# Altium schematic sheet BPF.SchDoc: Ararinha 6F
size A4; Revision: 2.0; SheetNumber: 6; SheetTotal: 7
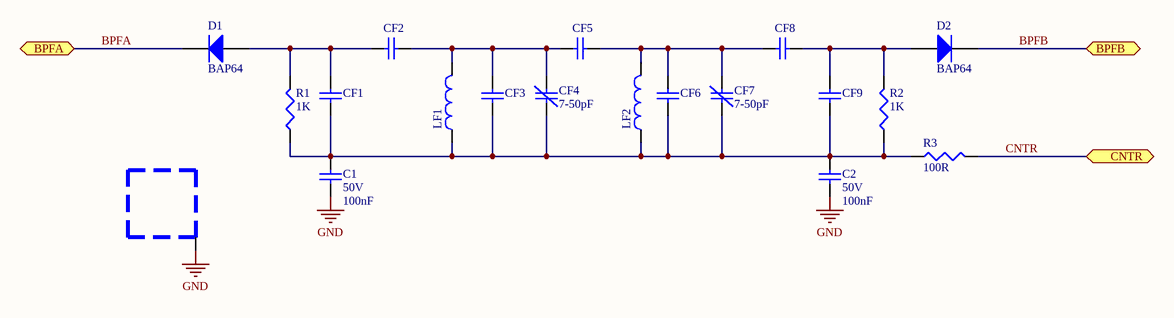
[diagram p0: BPF.SchDoc]

## Parts
BL1  Blindagem BPF  [SHIELD_26.5X26.5]  (value not drawn)
C1  value 100nF  Tensão: 50V  [CC0603]  (hidden comment: Capacitor Cerâmico)
C2  value 100nF  Tensão: 50V  [CC0603]  (hidden comment: Capacitor Cerâmico)
CF1  Capacitor Cerâmico  [CC0603]  (value not drawn)
CF2  Capacitor Cerâmico  [CC0603]  (value not drawn)
CF3  Capacitor Cerâmico  [CC0603]  (value not drawn)
CF4  value 7-50pF  [MURATA TZB4]  (hidden comment: Trimmer)
CF5  Capacitor Cerâmico  [CC0603]  (value not drawn)
CF6  Capacitor Cerâmico  [CC0603]  (value not drawn)
CF7  value 7-50pF  [MURATA TZB4]  (hidden comment: Trimmer)
CF8  Capacitor Cerâmico  [CC0603]  (value not drawn)
CF9  Capacitor Cerâmico  [CC0603]  (value not drawn)
D1  BAP64  [SOD523]
D2  BAP64  [SOD523]
LF1  Bead  [CC0603]  (value not drawn)
LF2  Bead  [CC0603]  (value not drawn)
R1  value 1K  [CC0603]  (hidden comment: Resistor)
R2  value 1K  [CC0603]  (hidden comment: Resistor)
R3  value 100R  [CC0603]  (hidden comment: Resistor)

## Ports
BPFA (bidir), BPFB (bidir), CNTR

## Nets
GND: BL1.1(GND) C1.1 C2.1
BPFA: D1.2(K) ; port BPFA
BPFB: D2.2(K) ; port BPFB
CNTR: R3.2 ; port CNTR
NetC1_2: C1.2 C2.2 CF1.1 CF3.2 CF4.1 CF6.1 CF7.1 CF9.2 LF1.1 LF2.1 R1.1 R2.1 R3.1
NetCF1_2: CF1.2 CF2.2 D1.1(A) R1.2
NetCF2_1: CF2.1 CF3.1 CF4.2 CF5.1 LF1.2
NetCF5_2: CF5.2 CF6.2 CF7.2 CF8.2 LF2.2
NetCF8_1: CF8.1 CF9.1 D2.1(A) R2.2

## Notes on the sheet
- Projeto:
- Tamanho:
- Data:
- A4
- Eng. Felipe Navarro
- Hora:
- Revisão:
- Folha
- de
- Arquivo:

## Library data of the parts
BL1 = Blindagem BPF: ChinesePrice: 0,00000; Chinês: ----; Corrente: *; Potência: *; Supplier 1: Digi-Key; Supplier Part Number 1: --Del; Tensão: *; Value: *; Obs:: *; Tolerância: *; ComponentLink1Description: Datasheet; ComponentLink1URL: D:\Tecnoclade\Datasheet\
C1 C2 = Cap 100nF 50V 0603 X7R: Capacitor (Semiconductor SIM Model); Chinês: Local; ChinesePrice: 0,00250; Corrente: *A; Potência: *W; Obs:: X7R; Tolerância: ±10%; Supplier 1: Digi-Key; Supplier Part Number 1: 1276-1000-1-ND; ComponentLink1Description: Datasheet; ComponentLink1URL: D:\Tecnoclade\Datasheet\!DataMissing.pdf
CF1-CF3 CF5 CF6 CF8 CF9 = Cap - $Val $V $Footprint $Classe_1: Capacitor (Semiconductor SIM Model); Chinês: ----; ChinesePrice: 0,00000; Corrente: *A; Potência: *W; Tolerância: ±*%; Tensão: 25V; Value: 100nF; Supplier 1: Digi-Key; Supplier Part Number 1: --Del; Obs:: *; ComponentLink1Description: Datasheet; ComponentLink1URL: D:\Tecnoclade\Datasheet\!DataMissing.pdf
CF4 CF7 = Trimmer 7-50pF 50V TZB4-BB: Capacitor (Semiconductor SIM Model); Chinês: ----; ChinesePrice: 0,00000; Corrente: *A; Potência: *W; Tolerância: ±*%; Tensão: 50V; Supplier 1: Digi-Key; Supplier Part Number 1: 490-1983-1-ND; Obs:: *; ComponentLink1Description: Datasheet; ComponentLink1URL: D:\Tecnoclade\Datasheet\!DataMissing.pdf
D1 D2 = PIN BAP64: PIN DIODE; ChinesePrice: 0,00000; Chinês: ----; Corrente: *; Potência: *; Supplier 1: Digi-Key; Supplier Part Number 1: 568-1929-1-ND; Tensão: *; Value: *; Obs:: *; Tolerância: *; ComponentLink1Description: Datasheet; ComponentLink1URL: D:\Tecnoclade\Datasheet\!DataMissing.pdf
LF1 LF2 = Bd 1K@100MHz 0603 400mA: ChinesePrice: 0,00000; Chinês: -----; Obs:: Ferrite (0R5); Tolerância: ±25%; Corrente: 400mA; Potência: *; Supplier 1: Digi-Key; Supplier Part Number 1: 445-1550-1-ND; Tensão: *; ComponentLink1Description: Datasheet; ComponentLink1URL: D:\Tecnoclade\Datasheet\!DataMissing.pdf; Substituição: 27/06/2014; Value: 1K@100MHz
R1 R2 = Res 1K 1% 0603 1/10W: ChinesePrice: 0,00089; Chinês: Local; Corrente: *A; Potência: 1/10W; Tensão: *V; Tolerância: ±1%; Supplier 1: Digi-Key; Supplier Part Number 1: RMCF0603FT1K00CT-ND; Obs: *; ComponentLink1Description: Datasheet; ComponentLink1URL: D:\Tecnoclade\Datasheet\!DataMissing.pdf
R3 = Res 100R 5% 0603 1/10W: ChinesePrice: 0,00080; Chinês: Local; Corrente: *A; Potência: 1/10W; Tensão: *V; Tolerância: ±5%; Supplier 1: Digi-Key; Supplier Part Number 1: RMCF0603JT100RCT-ND; Obs: *; ComponentLink1Description: Datasheet; ComponentLink1URL: D:\Tecnoclade\Datasheet\!DataMissing.pdf